# Altium schematic sheet VĐK.SchDoc
size A4; SheetNumber: 3; SheetTotal: 7
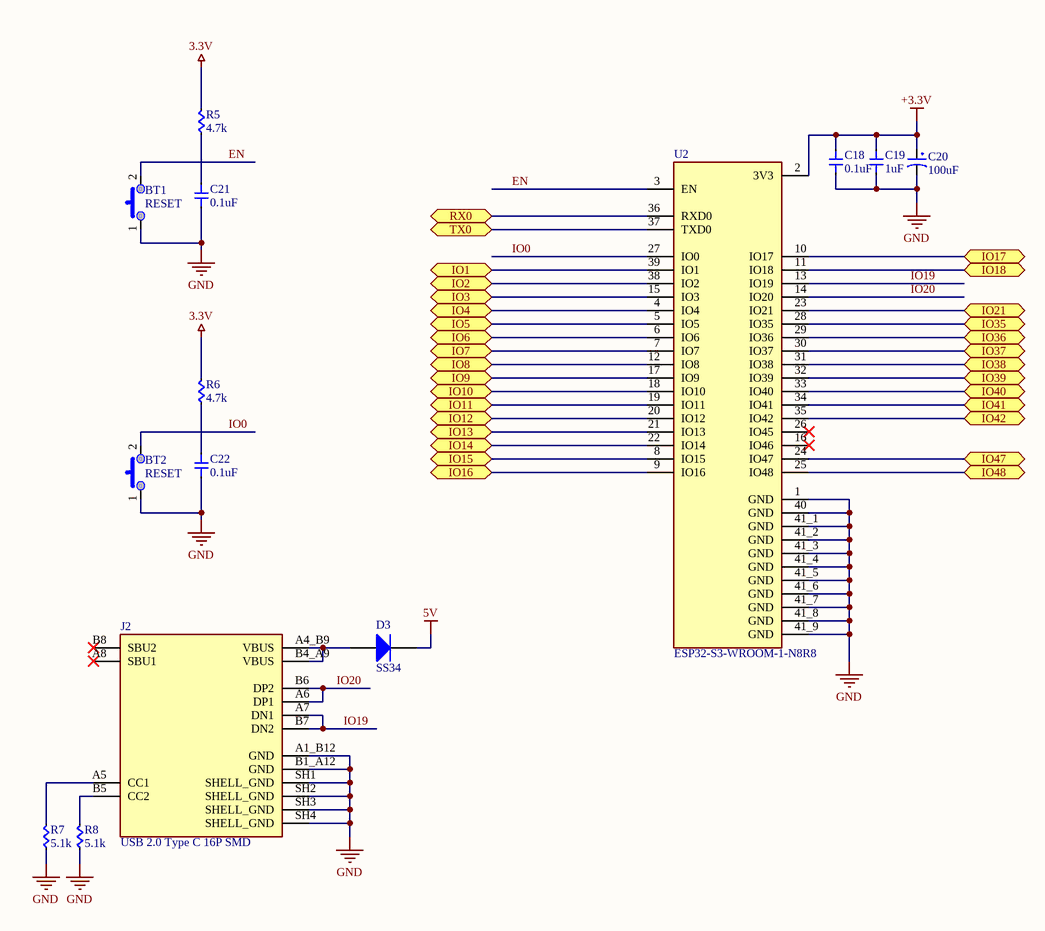
[diagram p0: VĐK.SchDoc]

## Parts
BT1  RESET  [B3U-1000P]
BT2  RESET  [B3U-1000P]
C18  0.1uF  [Cap 0603]
C19  1uF  [Cap 0603]
C20  100uF  [tu tantalum smd7343]
C21  0.1uF  [Cap 0603]
C22  0.1uF  [Cap 0603]
D3  SS34  [DIODE SMA]
J2  USB 2.0 Type C 16P SMD  [TYPE C 16P SMD]
R5  4.7k  [RES 0603]
R6  4.7k  [RES 0603]
R7  5.1k  [RES 0603]
R8  5.1k  [RES 0603]
U2  ESP32-S3-WROOM-1-N8R8  [XCVR_ESP32S3WROOM1N8R8]

## Ports
IO1 (bidir), IO2 (bidir), IO3 (bidir), IO4 (bidir), IO5 (bidir), IO6 (bidir), IO7 (bidir), IO8 (bidir), IO9 (bidir), IO10 (bidir), IO11 (bidir), IO12 (bidir), IO13 (bidir), IO14 (bidir), IO15 (bidir), IO16 (bidir), IO17 (bidir), IO18 (bidir), IO21 (bidir), IO35 (bidir), IO36 (bidir), IO37 (bidir), IO38 (bidir), IO39 (bidir), IO40 (bidir), IO41 (bidir), IO42 (bidir), IO47 (bidir), IO48 (bidir), RX0 (bidir), TX0 (bidir)

## Nets
3.3V: R5.2 R6.2
5V: D3.2(K)
+3.3V: C18.1 C19.1 C20.1 U2.2(3V3)
GND: BT1.1 BT2.1 C18.2 C19.2 C20.2 C21.2 C22.2 J2.A1_B12(GND) J2.B1_A12(GND) J2.SH1(SHELL_GND) J2.SH2(SHELL_GND) J2.SH3(SHELL_GND) J2.SH4(SHELL_GND) R7.1 R8.1 U2.1(GND) U2.40(GND) U2.41_1(GND) U2.41_2(GND) U2.41_3(GND) U2.41_4(GND) U2.41_5(GND) U2.41_6(GND) U2.41_7(GND) U2.41_8(GND) U2.41_9(GND)
EN: BT1.2 U2.3(EN)
IO0: BT2.2 U2.27(IO0)
IO1: U2.39(IO1) ; port IO1
IO2: U2.38(IO2) ; port IO2
IO3: U2.15(IO3) ; port IO3
IO4: U2.4(IO4) ; port IO4
IO5: U2.5(IO5) ; port IO5
IO6: U2.6(IO6) ; port IO6
IO7: U2.7(IO7) ; port IO7
IO8: U2.12(IO8) ; port IO8
IO9: U2.17(IO9) ; port IO9
IO10: U2.18(IO10) ; port IO10
IO11: U2.19(IO11) ; port IO11
IO12: U2.20(IO12) ; port IO12
IO13: U2.21(IO13) ; port IO13
IO14: U2.22(IO14) ; port IO14
IO15: U2.8(IO15) ; port IO15
IO16: U2.9(IO16) ; port IO16
IO17: U2.10(IO17) ; port IO17
IO18: U2.11(IO18) ; port IO18
IO19: J2.A7(DN1) J2.B7(DN2) U2.13(IO19)
IO20: J2.A6(DP1) J2.B6(DP2) U2.14(IO20)
IO21: U2.23(IO21) ; port IO21
IO35: U2.28(IO35) ; port IO35
IO36: U2.29(IO36) ; port IO36
IO37: U2.30(IO37) ; port IO37
IO38: U2.31(IO38) ; port IO38
IO39: U2.32(IO39) ; port IO39
IO40: U2.33(IO40) ; port IO40
IO41: U2.34(IO41) ; port IO41
IO42: U2.35(IO42) ; port IO42
IO47: U2.24(IO47) ; port IO47
IO48: U2.25(IO48) ; port IO48
RX0: U2.36(RXD0) ; port RX0
TX0: U2.37(TXD0) ; port TX0
NetC21_1: C21.1 R5.1
NetC22_1: C22.1 R6.1
NetD3_1: D3.1(A) J2.A4_B9(VBUS) J2.B4_A9(VBUS)
NetJ2_A5: J2.A5(CC1) R7.2
NetJ2_B5: J2.B5(CC2) R8.2

Not connected (* = marked no-connect by the designer): J2 A8(SBU1)* B8(SBU2)*; U2 16(IO46)* 26(IO45)*

## Library data of the parts
BT1 BT2 = Button_2p
C18 C19 C21 C22 = Cap 0603: Capacitor SMD 0603
C20 = Tu tantalum 100uF 25V SMD7343: Dán; Don_Vi: Con; So_Chan: 2; Ten_Linh_Kien: Tụ tantalum 107E-100uF 25V SMD7343; Ma_Hang: MH002347; Chung_Loai: Dán; Kieu_Chan: *
D3 = Diode SS34 ( 1N5822 ): Dán; Don_Vi: Con; Ma_Hang: MH002104; Ten_Linh_Kien: Diode SS34 3A 40V SMA ( 1N5822 SS34A); Kieu_Chan: *; Chung_Loai: Dán
J2 = USB 2.0 Type C 16P SMD: USB CONN, 2.0 TYPE C, RCPT, 16POS, SMT; USB Connector Type:USB Type C; USB Standard:USB 2.0; Gender:Receptacle; No. of Positions:16Positions; Connector Mounting:Surface Mount, Through Hole Mount; Orientation:Right Angle RoHS Compliant: Yes; MF: Global Connector Technology; MP: USB4105GFA120; SnapEDA_Link: https://www.snapeda.com/parts/USB4105GFA120/Global+Connector+Technology/view-part/?ref=snap; Package: None; Value: *; Check_prices: https://www.snapeda.com/parts/USB4105GFA120/Global+Connector+Technology/view-part/?ref=eda
R5-R8 = RES 0603: RES SMD 0603; Manufacturer: Vishay Dale; Manufacturer Part Number: CRCW040210K0FKED; Resistance (Ohms): 10k; Tolerance: ±1%; Power (Watts): 0.063W, 1/16W; Temperature Coefficient: ±100ppm/°C; Supplier 1: Digi-Key; RoHS: RoHS Compliant; Category: Resistors; Stock 1: 2392462; Pricing 1: 10=0.083, 50=0.0444, 200=0.0255, 1000=0.0174 (USD); Packaging: Cut Tape (CT); Composition: Thick Film; Features: Automotive AEC-Q200; Operating Temperature: -55°C ~ 155°C; Package / Case: 0402 (1005 Metric); Supplier Device Package: 0402 (1005 Metric); Size / Dimension: 0.039" L x 0.020" W (1.00mm x 0.50mm); Height: 0.016" (0.40mm); Number of Terminations: 2; ComponentLink1URL: http://www.vishay.com/docs/20035/dcrcwe3.pdf; ComponentLink1Description: http://www.vishay.com/docs/20035/dcrcwe3.pdf; Supplier Part Number 1: 541-10.0KLCT-ND
U2 = ESP32-S3-WROOM-1-N8R8: Bluetooth, WiFi 802.11b/g/n, Bluetooth v5.0 Transceiver Module 2.4GHz PCB Trace Surface Mount; MF: Espressif Systems; Package: None; Price: None; Check_prices: https://www.snapeda.com/parts/ESP32-S3-WROOM-1-N8R8/Espressif+Systems/view-part/?ref=eda; Value: *; SnapEDA_Link: https://www.snapeda.com/parts/ESP32-S3-WROOM-1-N8R8/Espressif+Systems/view-part/?ref=snap; MP: ESP32-S3-WROOM-1-N8R8; Availability: In Stock; Purchase-URL: https://pricing.snapeda.com/search?q=ESP32-S3-WROOM-1-N8R8&ref=eda